# EAGLE design hub-i-proto-wireant01 (EAGLE 7.2.0)
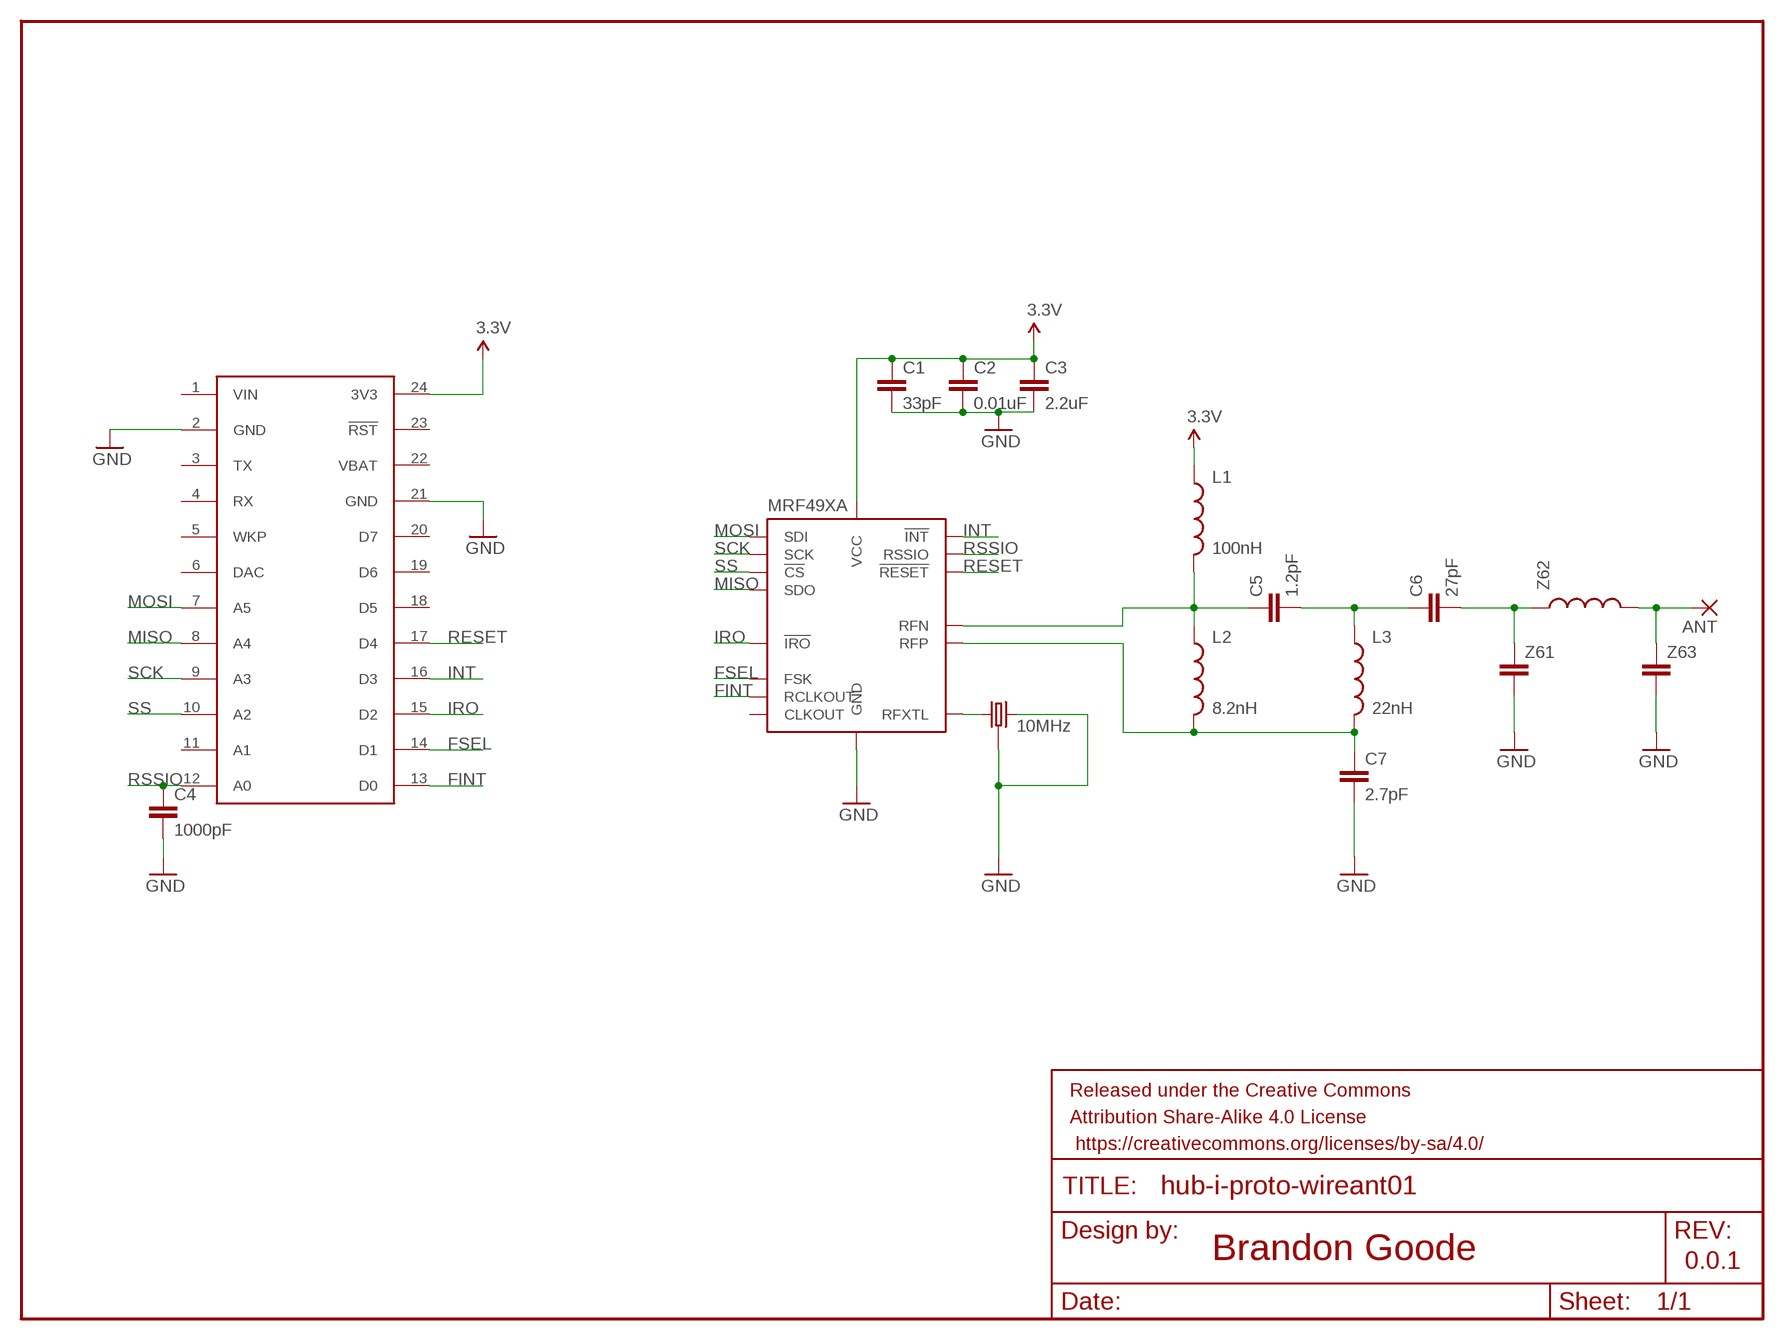
[diagram p0: schematic, sheet 1]

## Parts
ANT  WIREPAD1,6/0,8  [1,6/0,8]
C1  33pF  CAP0603-CAP  [0603-CAP]
C2  0.01uF  CAP0603-CAP  [0603-CAP]
C3  2.2uF  CAP0603-CAP  [0603-CAP]
C4  1000pF  CAP0603-CAP  [0603-CAP]
C5  1.2pF  CAP0603-CAP  [0603-CAP]
C6  27pF  CAP0603-CAP  [0603-CAP]
C7  2.7pF  CAP0603-CAP  [0603-CAP]
FRAME1  FRAME-LETTER  [CREATIVE_COMMONS]
L1  100nH  INDUCTOR0603  [0603]
L2  8.2nH  INDUCTOR0603  [0603]
L3  22nH  INDUCTOR0603  [0603]
MRF49XA  MRF49XATSSOP  [TSSOP16]
SPARK  SPARK_CORECORE  [SPARK_CORE]
Y1  10MHz  CRYSTAL-GROUNDED  [CRYSTAL-SMD-5X3]
Z61  CAP0603-CAP  [0603-CAP]
Z62  INDUCTOR0603  [0603]
Z63  CAP0603-CAP  [0603-CAP]

## Nets
3.3V: C1.1 C2.1 C3.1 L1.1 MRF49XA.14(VCC) SPARK.24(3V3)
ANT: ANT.1(P) Z62.2 Z63.1
FINT: MRF49XA.7(RCLKOUT) SPARK.13(D0)
FSEL: MRF49XA.6(FSK) SPARK.14(D1)
GND: C1.2 C2.2 C3.2 C4.2 C7.2 MRF49XA.11(GND) SPARK.2(GND) SPARK.21(GND) Y1.1 Y1.2 Y1.4 Z61.2 Z63.2
INT: MRF49XA.16(!INT) SPARK.16(D3)
IRO: MRF49XA.5(!IRO) SPARK.15(D2)
MISO: MRF49XA.4(SDO) SPARK.8(A4)
MOSI: MRF49XA.1(SDI) SPARK.7(A5)
N$1: C5.2 C6.1 L3.1
N$2: MRF49XA.9(RFXTL) Y1.3
N$3: C5.1 L1.2 L2.1 MRF49XA.13(RFN)
N$4: C7.1 L2.2 L3.2 MRF49XA.12(RFP)
N$5: C6.2 Z61.1 Z62.1
RESET: MRF49XA.10(!RESET) SPARK.17(D4)
RSSIO: C4.1 MRF49XA.15(RSSIO) SPARK.12(A0)
SCK: MRF49XA.2(SCK) SPARK.9(A3)
SS: MRF49XA.3(!CS) SPARK.10(A2)
Unconnected: MRF49XA.8(CLKOUT) SPARK.3(TX) SPARK.4(RX) SPARK.5(WKP) SPARK.6(DAC) SPARK.11(A1) SPARK.18(D5) SPARK.19(D6) SPARK.20(D7) SPARK.23(!RST)

## Notes on the sheet
- Brandon Goode
- 0.0.1

## Power pins joined to a net without a drawn wire
VBAT: SPARK.22(VBAT)
VIN: SPARK.1(VIN)

## Library data of the parts
ANT = wirepad:WIREPAD: Wire PAD connect wire on PCB
C1-C7 Z61 Z63 = SparkFun-Passives:CAP: Capacitor Standard 0603 ceramic capacitor, and 0.1" leaded capacitor.
FRAME1 = SparkFun-Aesthetics:FRAME-LETTER: Schematic Frame Standard 8.5x11 US Letter frame
L1-L3 Z62 = SparkFun-Passives:INDUCTOR: Inductors Basic Inductor/Choke - 0603 and 1206. Footprints are not proven and vary greatly between part numbers. SRN6045- 33uH, 20% 1.4A SDR0403-560KL - 56uH, 10%, 500mA RMS/740mA peak
MRF49XA = AutomateGreen:MRF49XA: Microchip MRF49XA ISM Band Sub-GHz RF Transceiver (433 MHz, 868 MHz and 915 MHz). http://ww1.microchip.com/downloads/en/DeviceDoc/70590C.pdf
SPARK = Spark:SPARK_CORE
Y1 = AutomateGreen:CRYSTAL-GROUNDED

## Board
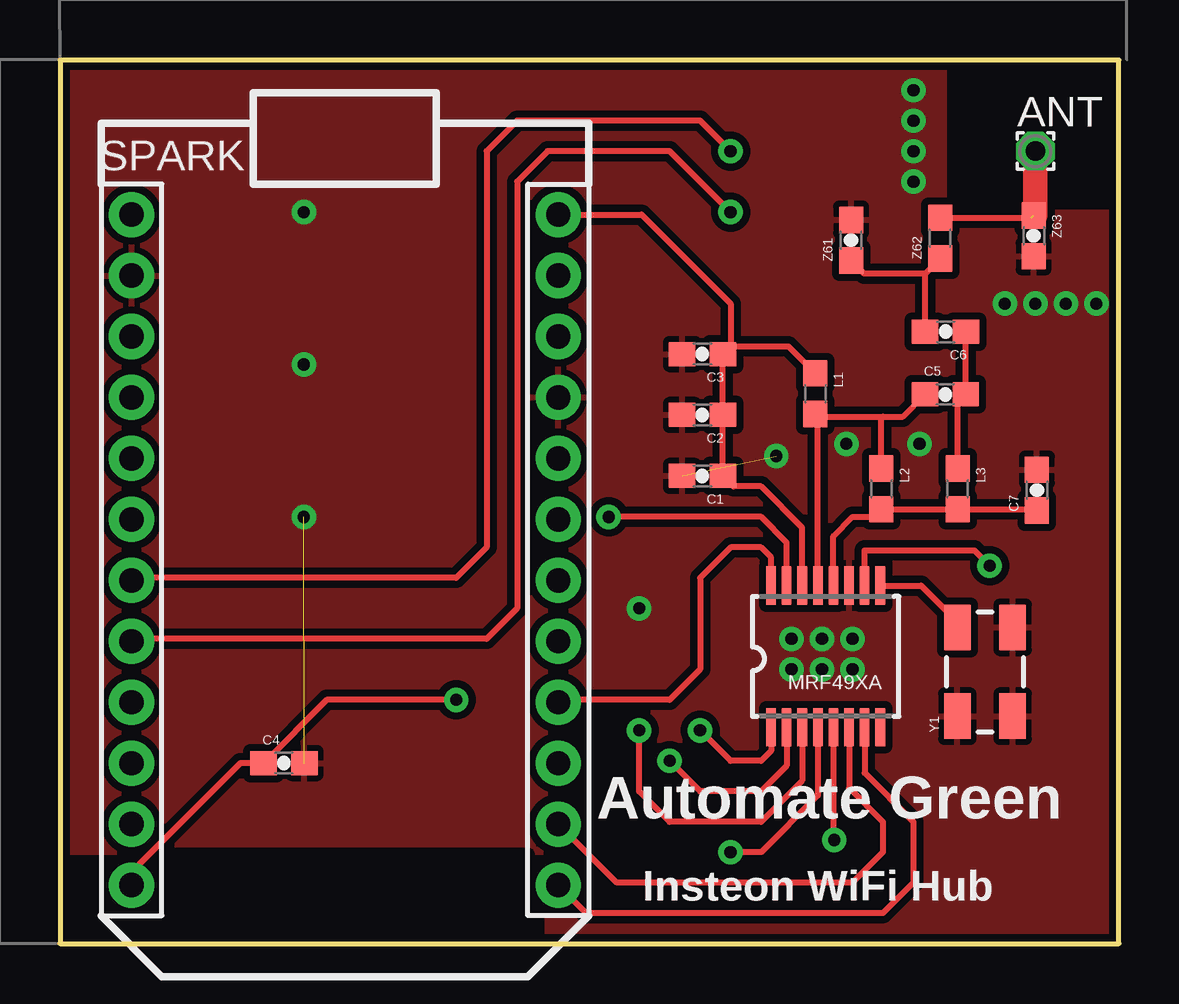
[diagram p1: board, top side]
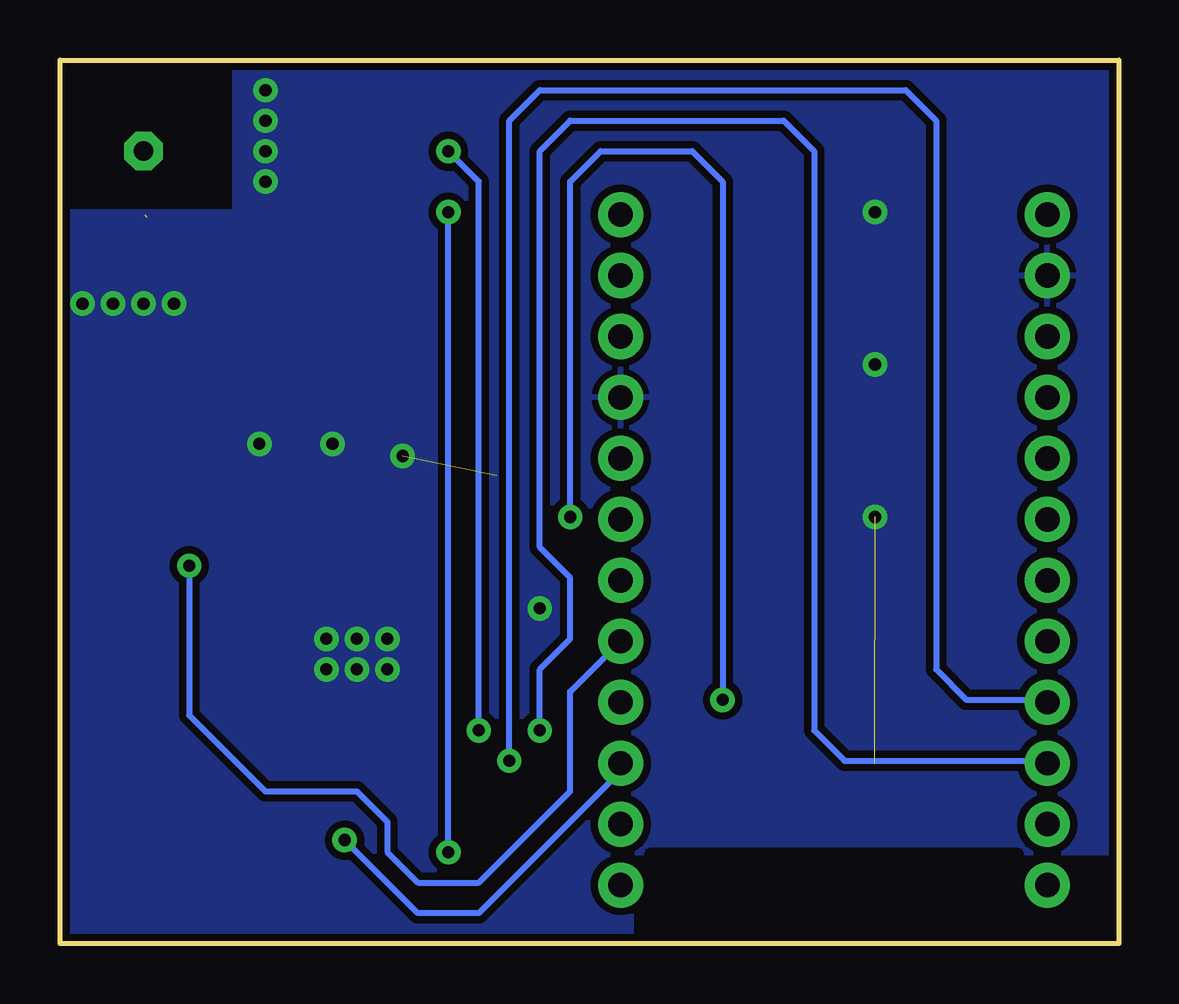
[diagram p2: board, bottom side, seen from below]

Size 44.12 x 36.82 mm. Coordinates in mm from the lower left corner, seen from the top.
Outline: 0,0 44.12,0 44.12,36.82 0,36.82 0,0
Copper layers (1*16): Top 0.035mm / dielectric 1.5mm / Bottom 0.035mm
Design rules "SparkFun-2-layer": minimum track width 7mil, minimum drill 15mil, track to track 8mil, track to pad 8mil, pad to pad 8mil, via to via 8mil, smd to smd 8mil, copper to edge 8mil, drill to drill 8mil, minimum pad ring 12mil, minimum via ring 10mil, stop-mask expansion 4mil, vias tented up to drill 20mil, thermal gap 10mil

### Footprints (pad centres in the part's own frame; a part is rotated, then mirrored left to right if it is on the bottom)
1,6/0,8 = drill 0.813 pad 1.6 octagon: 1 0,0
0603-CAP = smd 1.1 x 1: 1 -0.85,0; 2 0.85,0
0603 = smd 1.1 x 1: 1 -0.85,0; 2 0.85,0
TSSOP16 = smd 0.4 x 1.6: 1 -2.225,-2.85; 2 -1.575,-2.85; 3 -0.925,-2.85; 4 -0.275,-2.85; 5 0.375,-2.85; 6 1.025,-2.85; 7 1.675,-2.85; 8 2.325,-2.85; 9 2.325,3.05; 10 1.675,3.05; 11 1.025,3.05; 12 0.375,3.05; 13 -0.275,3.05; 14 -0.925,3.05; 15 -1.575,3.05; 16 -2.225,3.05
SPARK_CORE = drill 1.016 pad 1.88: 1 -8.89,13.97; 2 -8.89,11.43; 3 -8.89,8.89; 4 -8.89,6.35; 5 -8.89,3.81; 6 -8.89,1.27; 7 -8.89,-1.27; 8 -8.89,-3.81; 9 -8.89,-6.35; 10 -8.89,-8.89; 11 -8.89,-11.43; 12 -8.89,-13.97; 13 8.89,-13.97; 14 8.89,-11.43; 15 8.89,-8.89; 16 8.89,-6.35; 17 8.89,-3.81; 18 8.89,-1.27; 19 8.89,1.27; 20 8.89,3.81; 21 8.89,6.35; 22 8.89,8.89; 23 8.89,11.43; 24 8.89,13.97
CRYSTAL-SMD-5X3 = smd 1.9 x 1.1: 1 -1.85,-1.15; 2 1.85,-1.15; 3 1.85,1.15; 4 -1.85,1.15

### Placement (x,y rotation side)
ANT  40.64,33.02 0 top
C1  26.77,19.49 180 top
C2  26.77,22.03 180 top
C3  26.77,24.57 180 top
C4  9.33,7.52 0 top
C5  36.89,22.89 0 top
C6  36.9,25.5 180 top
C7  40.71,18.9 90 top
FRAME1  1.27,-8.89 0 top  (outside the outline)
L1  31.47,22.92 270 top
L2  34.22,18.95 270 top
L3  37.4,18.95 270 top
MRF49XA  31.85,11.87 0 top
SPARK  11.87,16.41 0 top
Y1  38.54,11.33 90 top
Z61  32.96,29.31 90 top
Z62  36.68,29.4 90 top
Z63  40.57,29.49 270 top

### Tracks (layer width: path | path; a pad name or v marks a point on that pad's centre or on a via)
3.3V
  Top 0.254: MRF49XA.14 30.93,17.34 29.21,19.05 28.06,19.05 C1.1 C2.1 C3.1 27.94,24.89 | SPARK.24 24.23,30.38 27.94,26.67 27.94,24.89 | 27.94,24.89 30.35,24.89 L1.1
ANT  (1 unrouted)
  Top 0.254: Z62.2 40.48,30.25 | 40.57,32.95 ANT.1
  Top 1.016: Z63.1 40.64,30.34 ANT.1
FINT
  Top 0.254: MRF49XA.7 33.52,7.12 35.56,5.08 35.56,2.54 34.29,1.27 21.93,1.27 SPARK.13 20.86,2.54
FSEL
  Top 0.254: MRF49XA.6 32.88,6.5 34.29,5.08 34.29,3.81 33.02,2.54 23.2,2.54 SPARK.14
GND  (via drill 0.51)  (2 unrouted)
  other vias: 30.48,12.7 31.75,12.7 30.48,11.43 31.75,11.43 33.02,12.7 33.02,11.43 29.84,20.32 10.16,30.48 10.16,24.13 10.16,17.78 24.13,13.97 35.56,35.56 35.56,34.29 35.56,33.02 35.56,31.75 39.37,26.67 40.64,26.67 41.91,26.67 43.18,26.67 32.77,20.83 35.81,20.83
  pour Top (isolate 0.305): 0,36.83 36.83,36.83 36.83,30.48 44.45,30.48 44.45,0 20.32,0 20.32,3.81 3.81,3.81 0,3.81
  pour Bottom (isolate 0.305): 0,36.83 36.83,36.83 36.83,30.48 44.45,30.48 44.45,0 20.32,0 20.32,3.81 3.81,3.81 0,3.81
INT
  Top 0.254: MRF49XA.16 29.62,16.09 29.21,16.51 27.94,16.51 26.67,15.24 26.67,11.43 25.4,10.16 20.86,10.16 SPARK.16
IRO  (via drill 0.51)
  Top 0.254: MRF49XA.5 32.23,4.35 v32.26,4.32
  Bottom 0.254: SPARK.15 20.76,7.18 26.67,1.27 29.21,1.27 v32.26,4.32
MISO  (via drill 0.51)
  Top 0.254: MRF49XA.4 31.57,6.17 29.21,3.81 v27.94,3.81 | v27.94,30.48 25.4,33.02 20.32,33.02 19.05,31.75 19.05,13.97 17.78,12.7 3.08,12.7 SPARK.8
  Bottom 0.254: v27.94,3.81 v27.94,30.48
MOSI  (via drill 0.51)
  Top 0.254: MRF49XA.1 29.62,8.04 29.21,7.62 27.94,7.62 v26.67,8.89 | v27.94,33.02 26.67,34.29 19.05,34.29 17.78,33.02 17.78,16.51 16.51,15.24 3.08,15.24 SPARK.7
  Bottom 0.254: v26.67,8.89 26.67,31.75 v27.94,33.02
N$1
  Top 0.254: C6.1 37.74,25.49 C5.2 37.4,22.55 L3.1
N$2
  Top 0.254: MRF49XA.9 35.88,14.92 36.2,14.61 36.83,13.97 37.39,13.41 Y1.3
N$3
  Top 0.254: MRF49XA.13 31.57,21.96 | 31.57,21.96 L1.2 | 31.57,21.96 34.29,21.96 | 34.29,21.96 35.12,21.96 C5.1 | L2.1 34.22,21.89 34.29,21.96
N$4
  Top 0.254: MRF49XA.12 32.23,16.98 33.02,17.78 33.9,17.78 L2.2 L3.2 40.65,18.1 C7.1
N$5
  Top 0.254: C6.2 36.05,27.92 | 36.05,27.92 Z62.1 | 36.05,27.92 33.5,27.92 Z61.1
RESET  (via drill 0.51)
  Top 0.254: MRF49XA.10 33.52,16.38 33.53,16.38 38.1,16.38 v38.73,15.75
  Bottom 0.254: v38.73,15.75 38.73,9.53 35.56,6.35 31.75,6.35 30.48,5.08 30.48,3.81 29.21,2.54 26.67,2.54 22.86,6.35 22.86,10.5 SPARK.17
RSSIO  (via drill 0.51)
  Top 0.254: SPARK.12 2.88,2.54 2.54,2.54 7.52,7.52 C4.1 11.12,10.16 v16.51,10.16 | MRF49XA.15 30.27,16.71 29.21,17.78 v22.86,17.78
  Bottom 0.254: v22.86,17.78 22.86,31.75 21.59,33.02 17.78,33.02 16.51,31.75 v16.51,10.16
SCK  (via drill 0.51)
  Top 0.254: MRF49XA.2 30.27,7.42 29.21,6.35 26.67,6.35 v25.4,7.62
  Bottom 0.254: v25.4,7.62 25.4,34.29 24.13,35.56 8.89,35.56 7.62,34.29 7.62,11.43 6.35,10.16 3.08,10.16 SPARK.9
SS  (via drill 0.51)
  Top 0.254: MRF49XA.3 30.93,6.79 29.21,5.08 25.4,5.08 24.13,6.35 v24.13,8.89
  Bottom 0.254: SPARK.10 3.08,7.62 11.43,7.62 12.7,8.89 12.7,33.02 13.97,34.29 22.86,34.29 24.13,33.02 24.13,16.51 22.86,15.24 22.86,12.7 24.13,11.43 v24.13,8.89

### Text on the board
tPlace: Automate Green | Insteon WiFi Hub
tDocu: Brandon Goode